# EAGLE schematic LED-RGB (EAGLE 7.6.0)
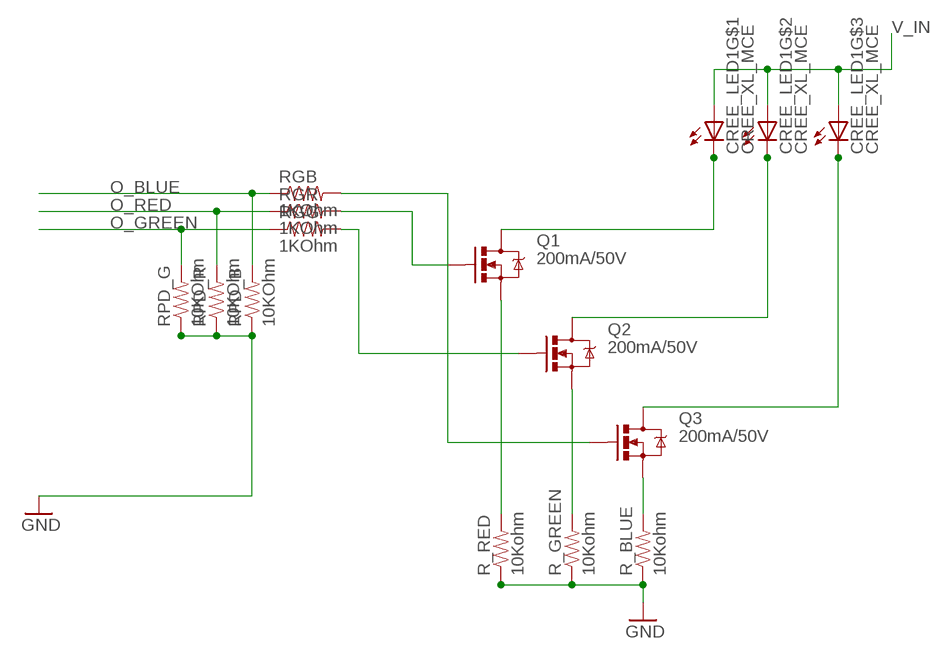
[diagram p0: schematic, sheet 1]

## Parts
CREE_LED1  CREE_XL_MCE  [CREE_XL_MCE]
Q1  200mA/50V  MOSFET-NCHANNELBSS138  [SOT23-3]
Q2  200mA/50V  MOSFET-NCHANNELBSS138  [SOT23-3]
Q3  200mA/50V  MOSFET-NCHANNELBSS138  [SOT23-3]
R_BLUE  10Kohm  RESISTOR0805-RES  [0805]
R_GREEN  10Kohm  RESISTOR0805-RES  [0805]
R_RED  10Kohm  RESISTOR0805-RES  [0805]
RGB  1KOhm  RESISTOR0805-RES  [0805]
RGG  1KOhm  RESISTOR0805-RES  [0805]
RGR  1KOhm  RESISTOR0805-RES  [0805]
RPD_B  10KOhm  RESISTOR0805-RES  [0805]
RPD_G  10KOhm  RESISTOR0805-RES  [0805]
RPD_R  10KOhm  RESISTOR0805-RES  [0805]

## Nets
GND: R_BLUE.1 R_GREEN.1 R_RED.1 RPD_B.1 RPD_G.1 RPD_R.1
N$1 [SUPPLY]: Q3.2(S) R_BLUE.2
N$2 [SUPPLY]: Q2.2(S) R_GREEN.2
N$3 [SUPPLY]: Q1.2(S) R_RED.2
N$4: Q2.1(G) RGG.2
N$5: Q1.1(G) RGR.2
N$6: Q3.1(G) RGB.2
N$7 [SUPPLY]: CREE_LED1.8(C) Q1.3(D)
N$8 [SUPPLY]: CREE_LED1.7(C) Q2.3(D)
N$9 [SUPPLY]: CREE_LED1.6(C) Q3.3(D)
O_BLUE: RGB.1 RPD_B.2
O_GREEN: RGG.1 RPD_G.2
O_RED: RGR.1 RPD_R.2
V_IN [SUPPLY]: CREE_LED1.1(A) CREE_LED1.2(A) CREE_LED1.3(A)
Unconnected: CREE_LED1.4(A) CREE_LED1.5(C) CREE_LED1.HT(TH:TH)

## Library data of the parts
CREE_LED1 = CreeXL-MC-E:CREE_XL_MCE: Cree® LED
Q1-Q3 = SparkFun-DiscreteSemi:MOSFET-NCHANNEL: Common NMOSFET Parts MFG P/N Store ID Prod ID FDD8780 TRANS-09984 SI7820DN TRANS-11055 FDS6630A IC-08089 2N7002PW TRANS-11151 FQP30N06L COM-10213 TRANS-10060 BSS123LT1G TRANS-08345 BSS138 TRANS-00830 BS170 2N7000; PROD_ID: TRANS-00830
R_BLUE R_GREEN R_RED RGB RGG RGR RPD_B RPD_G RPD_R = SparkFun-Resistors:RESISTOR: Resistor Basic schematic elements and footprints for 0603, 1206, and PTH resistors.

## Net classes
0 default: width 0.3 mm
1 GND: width 0.5 mm, clearance 0.5 mm
2 SUPPLY: width 0.5 mm, clearance 0.003 mm